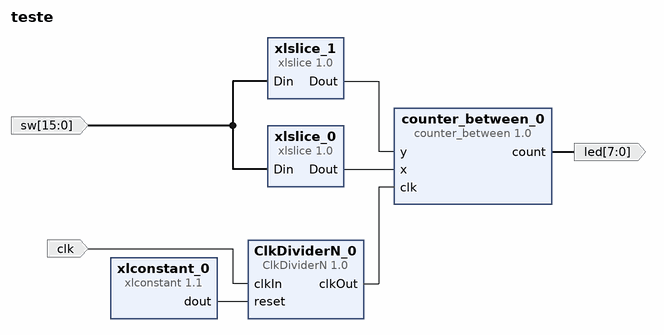
[diagram p0: block diagram of the top level]
# Vivado block design teste, xc7a100tcsg324-3, Vivado 2016.4
create_bd_design teste

create_bd_port -dir I clk
create_bd_port -dir I -from 15 -to 0 sw
create_bd_port -dir O -from 7 -to 0 led

create_bd_cell -type ip -vlnv xilinx.com:ip:xlslice:1.0 xlslice_0
set_property -dict {CONFIG.DOUT_WIDTH 8 CONFIG.DIN_TO 8 CONFIG.DIN_FROM 15 CONFIG.DIN_WIDTH 16} [get_bd_cells xlslice_0]
create_bd_cell -type ip -vlnv xilinx.com:ip:xlslice:1.0 xlslice_1
set_property -dict {CONFIG.DOUT_WIDTH 8 CONFIG.DIN_TO 0 CONFIG.DIN_FROM 7 CONFIG.DIN_WIDTH 16} [get_bd_cells xlslice_1]
create_bd_cell -type ip -vlnv xilinx.com:user:ClkDividerN:1.0 ClkDividerN_0
set_property -dict {CONFIG.divFactor 100000000} [get_bd_cells ClkDividerN_0]
create_bd_cell -type ip -vlnv xilinx.com:ip:xlconstant:1.1 xlconstant_0
set_property -dict {CONFIG.CONST_VAL 0} [get_bd_cells xlconstant_0]
create_bd_cell -type ip -vlnv xilinx.com:user:counter_between:1.0 counter_between_0

# ---- connections ----

connect_bd_net [get_bd_ports sw] [get_bd_pins xlslice_0/Din] [get_bd_pins xlslice_1/Din]
connect_bd_net [get_bd_pins xlconstant_0/dout] [get_bd_pins ClkDividerN_0/reset]
connect_bd_net [get_bd_ports clk] [get_bd_pins ClkDividerN_0/clkIn]
connect_bd_net [get_bd_pins counter_between_0/count] [get_bd_ports led]
connect_bd_net [get_bd_pins ClkDividerN_0/clkOut] [get_bd_pins counter_between_0/clk]
connect_bd_net [get_bd_pins xlslice_0/Dout] [get_bd_pins counter_between_0/x]
connect_bd_net [get_bd_pins xlslice_1/Dout] [get_bd_pins counter_between_0/y]

validate_bd_design
save_bd_design
